# EAGLE design NixieClock (EAGLE 9.6.2)
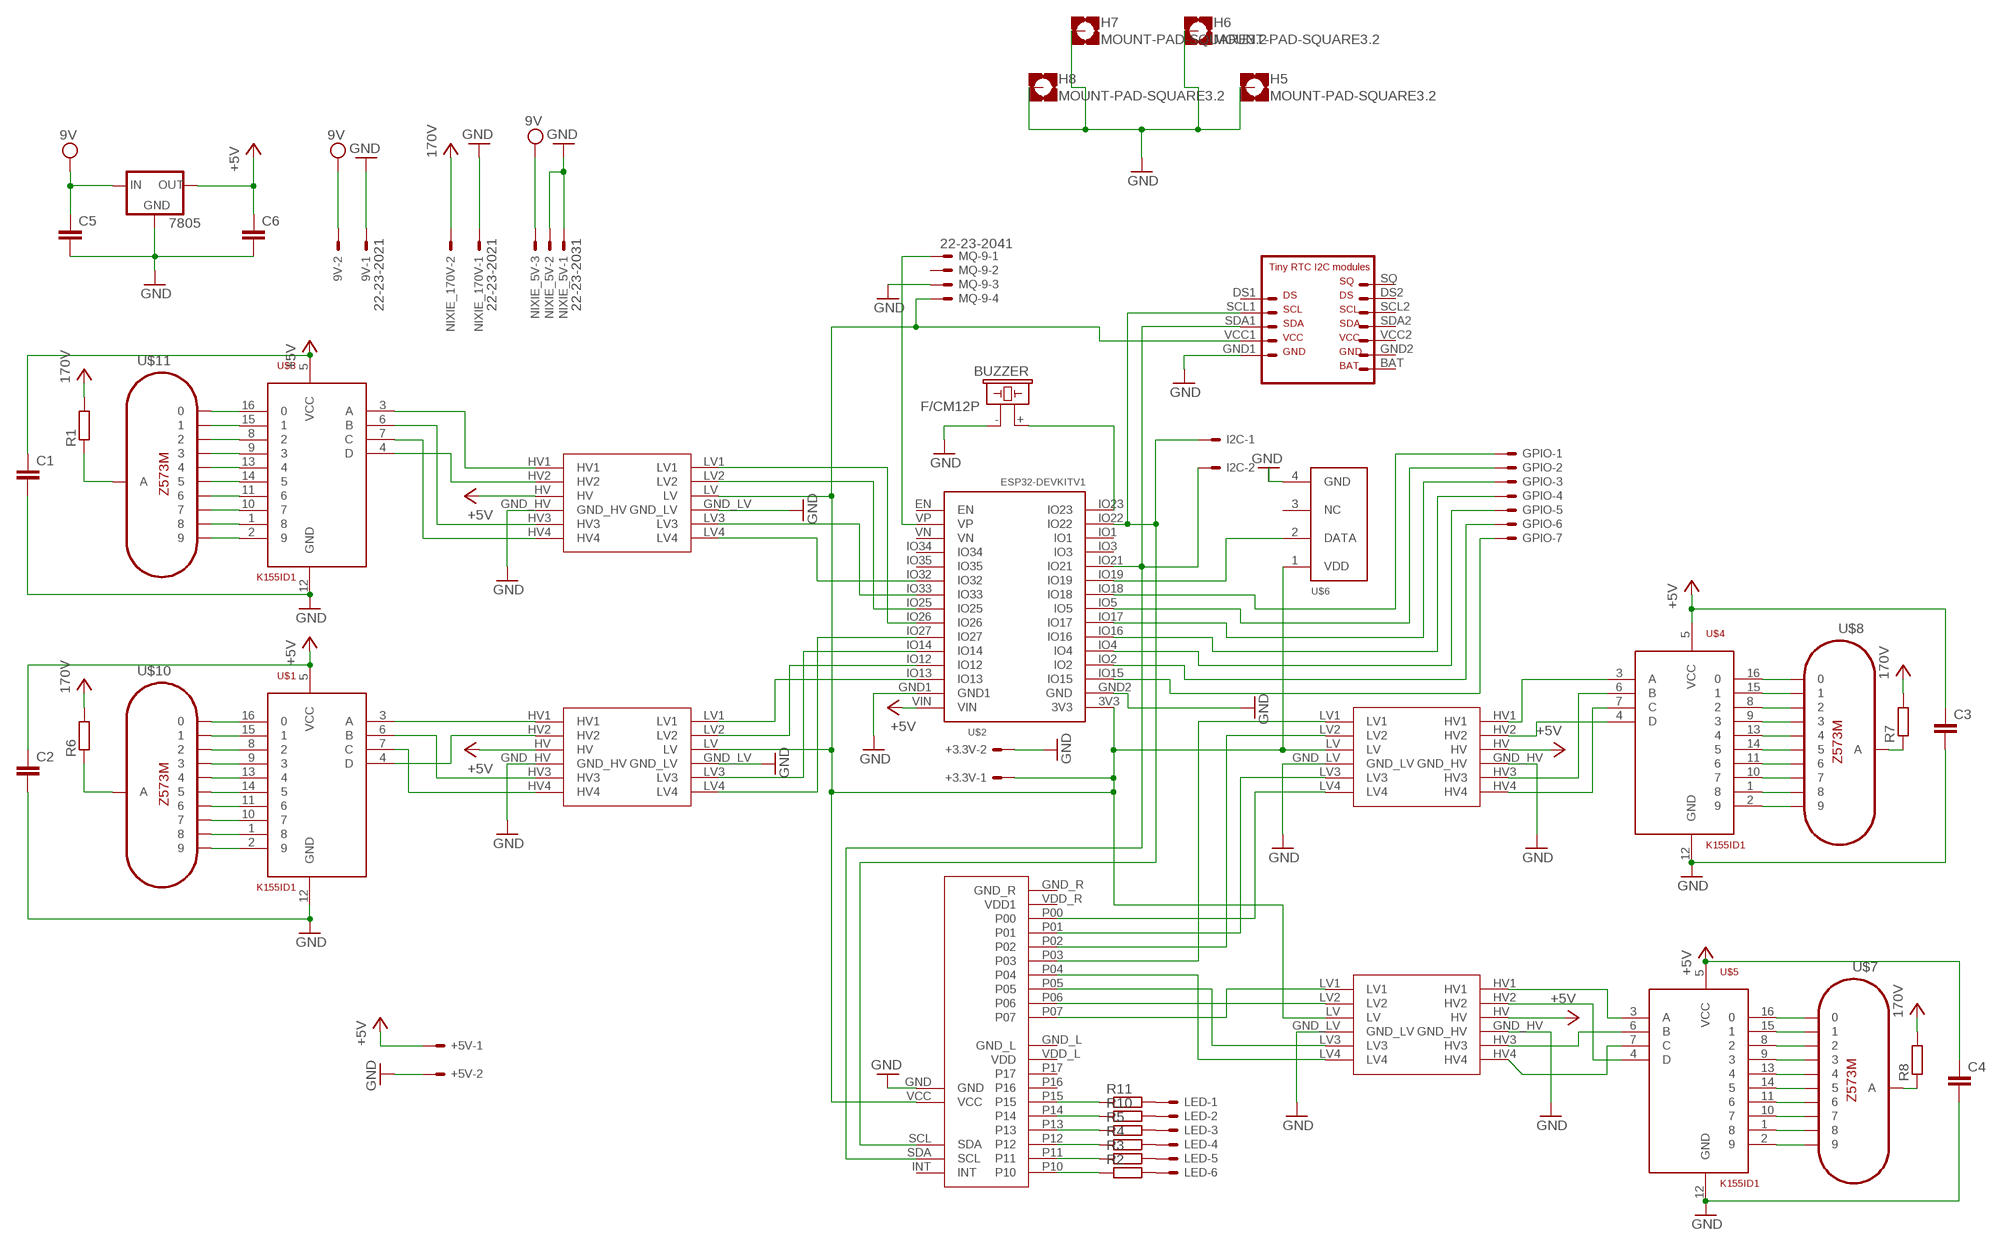
[diagram p0: schematic, sheet 1]

## Parts
9V  22-23-2021  [22-23-2021]
7805  78XXS  [78XXS]
+3.3V  KK-156-2  [KK-156-2]
+5V  KK-156-2  [KK-156-2]
BUZZER  F/CM12P  [F/CM12P]
C1  C2,5-3  [C2.5-3]
C2  C2,5-3  [C2.5-3]
C3  C2,5-3  [C2.5-3]
C4  C2,5-3  [C2.5-3]
C5  C2,5-3  [C2.5-3]
C6  C2,5-3  [C2.5-3]
GPIO  KK-156-7  [KK-156-7]
H5  MOUNT-PAD-SQUARE3.2  [3,2-PAD-SQUARE]
H6  MOUNT-PAD-SQUARE3.2  [3,2-PAD-SQUARE]
H7  MOUNT-PAD-SQUARE3.2  [3,2-PAD-SQUARE]
H8  MOUNT-PAD-SQUARE3.2  [3,2-PAD-SQUARE]
I2C  KK-156-2  [KK-156-2]
LED  KK-156-6  [KK-156-6]
MQ-9  22-23-2041  [22-23-2041]
NIXIE_5V  22-23-2031  [22-23-2031]
NIXIE_170V  22-23-2021  [22-23-2021]
R1  R-EU_0204/7  [0204/7]
R2  R-EU_0204/7  [0204/7]
R3  R-EU_0204/7  [0204/7]
R4  R-EU_0204/7  [0204/7]
R5  R-EU_0204/7  [0204/7]
R6  R-EU_0204/7  [0204/7]
R7  R-EU_0204/7  [0204/7]
R8  R-EU_0204/7  [0204/7]
R10  R-EU_0204/7  [0204/7]
R11  R-EU_0204/7  [0204/7]
STEP_UP_$  LEVEL-CONVERTER  [LEVEL-CONVERTER]
U$1  K155ID1  [DIP16-2.54-19.2X7.62MM]
U$2  ESP32DEVKITV1  [ESP32-DEVKITV1]
U$3  K155ID1  [DIP16-2.54-19.2X7.62MM]
U$4  K155ID1  [DIP16-2.54-19.2X7.62MM]
U$5  K155ID1  [DIP16-2.54-19.2X7.62MM]
U$6  DHT11  [DHT11]
U$7  Z573M  [Z573M]
U$8  Z573M  [Z573M]
U$9  RTC  [RTC]
U$10  Z573M  [Z573M]
U$11  Z573M  [Z573M]
U$12  LEVEL-CONVERTER  [LEVEL-CONVERTER]
U$13  LEVEL-CONVERTER  [LEVEL-CONVERTER]
U$15  LEVEL-CONVERTER  [LEVEL-CONVERTER]
U$16  PCF8575  [PCF8575]

## Nets
3.3V: +3.3V.1 MQ-9.4 STEP_UP_$.LV U$2.3V3 U$6.1(VDD) U$9.VCC1 U$12.LV U$13.LV U$15.LV U$16.VCC
170V: 9V.2 7805.IN C5.1 NIXIE_5V.3 NIXIE_170V.2 R1.2 R6.2 R7.2 R8.2 ; supply symbol labelled 9V
+5V: 7805.OUT +5V.1 C1.1 C2.1 C3.1 C4.1 C6.1 STEP_UP_$.HV U$1.5(VCC) U$2.VIN U$3.5(VCC) U$4.5(VCC) U$5.5(VCC) U$12.HV U$13.HV U$15.HV
GND: 9V.1 7805.GND +3.3V.2 +5V.2 BUZZER.- C1.2 C2.2 C3.2 C4.2 C5.2 C6.2 H5.B3,2(MOUNT) H6.B3,2(MOUNT) H7.B3,2(MOUNT) H8.B3,2(MOUNT) MQ-9.3 NIXIE_5V.1 NIXIE_5V.2 NIXIE_170V.1 STEP_UP_$.GND_HV STEP_UP_$.GND_LV U$1.12(GND) U$2.GND1 U$2.GND2(GND) U$3.12(GND) U$4.12(GND) U$5.12(GND) U$6.4(GND) U$9.GND1 U$12.GND_HV U$12.GND_LV U$13.GND_HV U$13.GND_LV U$15.GND_HV U$15.GND_LV U$16.GND
N$1: STEP_UP_$.HV1 U$5.3(A)
N$2: STEP_UP_$.HV2 U$5.4(D)
N$3: STEP_UP_$.HV3 U$5.6(B)
N$4: STEP_UP_$.HV4 U$5.7(C)
N$5: U$15.LV4 U$16.P00
N$6: U$4.3(A) U$15.HV1
N$7: U$4.4(D) U$15.HV2
N$8: U$4.6(B) U$15.HV3
N$9: U$3.3(A) U$13.HV1
N$10: U$3.4(D) U$13.HV2
N$11: U$3.6(B) U$13.HV3
N$12: U$3.7(C) U$13.HV4
N$13: U$1.3(A) U$12.HV1
N$14: U$1.4(D) U$12.HV2
N$15: U$1.6(B) U$12.HV3
N$16: U$1.7(C) U$12.HV4
N$17: U$3.16 U$11.K0
N$18: U$3.15 U$11.K1
N$19: U$3.8 U$11.K2
N$20: U$3.9 U$11.K3
N$21: U$3.13 U$11.K4
N$22: U$3.14 U$11.K5
N$23: U$3.11 U$11.K6
N$24: U$3.10 U$11.K7
N$25: U$3.1 U$11.K8
N$26: U$3.2 U$11.K9
N$27: U$1.16 U$10.K0
N$28: U$1.15 U$10.K1
N$29: U$1.8 U$10.K2
N$30: U$1.9 U$10.K3
N$31: U$1.13 U$10.K4
N$32: U$1.14 U$10.K5
N$33: U$1.11 U$10.K6
N$34: U$1.10 U$10.K7
N$35: U$1.1 U$10.K8
N$36: U$1.2 U$10.K9
N$37: U$5.16 U$7.K0
N$38: U$5.15 U$7.K1
N$39: U$5.8 U$7.K2
N$40: U$5.9 U$7.K3
N$41: U$5.13 U$7.K4
N$42: U$5.14 U$7.K5
N$43: U$5.11 U$7.K6
N$44: U$5.10 U$7.K7
N$45: U$5.1 U$7.K8
N$46: U$5.2 U$7.K9
N$47: U$4.2 U$8.K9
N$48: U$4.1 U$8.K8
N$49: U$4.10 U$8.K7
N$50: U$4.11 U$8.K6
N$51: U$4.14 U$8.K5
N$52: U$4.13 U$8.K4
N$53: U$4.9 U$8.K3
N$54: U$4.8 U$8.K2
N$55: U$4.15 U$8.K1
N$56: U$4.16 U$8.K0
N$57: U$15.LV3 U$16.P01
N$58: U$2.IO27 U$12.LV4
N$59: I2C.1 U$2.IO22 U$9.SCL1 U$16.SCL(SDA)
N$60: I2C.2 U$2.IO21 U$9.SDA1 U$16.SDA(SCL)
N$61: BUZZER.+ U$2.IO23
N$62: U$15.LV2 U$16.P02
N$63: MQ-9.1 U$2.VP
N$64: U$15.LV1 U$16.P03
N$65: STEP_UP_$.LV4 U$16.P04
N$66: STEP_UP_$.LV3 U$16.P05
N$68: STEP_UP_$.LV2 U$16.P06
N$69: STEP_UP_$.LV1 U$16.P07
N$70: U$2.IO19 U$6.2(DATA)
N$71: GPIO.1 U$2.IO18
N$72: GPIO.2 U$2.IO5
N$73: U$2.IO26 U$13.LV1
N$74: U$2.IO25 U$13.LV2
N$75: U$2.IO33 U$13.LV3
N$76: U$2.IO32 U$13.LV4
N$77: U$2.IO13 U$12.LV1
N$78: U$2.IO12 U$12.LV2
N$79: U$2.IO14 U$12.LV3
N$80: R8.1 U$7.A
N$81: R7.1 U$8.A
N$82: R6.1 U$10.A
N$83: R1.1 U$11.A
N$84: GPIO.3 U$2.IO17
N$85: R2.1 U$16.P10
N$86: R3.1 U$16.P11
N$87: R4.1 U$16.P12
N$88: R5.1 U$16.P13
N$89: R10.1 U$16.P14
N$90: R11.1 U$16.P15
N$91: LED.1 R11.2
N$92: LED.2 R10.2
N$93: LED.3 R5.2
N$94: LED.4 R4.2
N$95: LED.5 R3.2
N$96: LED.6 R2.2
N$97: GPIO.4 U$2.IO16
N$98: GPIO.5 U$2.IO4
N$99: GPIO.6 U$2.IO2
N$100: GPIO.7 U$2.IO15
N$104: U$4.7(C) U$15.HV4
Unconnected: MQ-9.2 U$2.EN U$2.IO1 U$2.IO3 U$2.IO34 U$2.IO35 U$2.VN U$6.3(NC) U$9.BAT U$9.DS1 U$9.DS2 U$9.GND2 U$9.SCL2 U$9.SDA2 U$9.SQ U$9.VCC2 U$16.GND_L U$16.GND_R U$16.INT U$16.P16 U$16.P17 U$16.VDD_L(VDD) U$16.VDD_R(VDD1)

## Library data of the parts
9V NIXIE_170V = con-molex:22-23-2021: .100" (2.54mm) Center Header - 2 Pin; MF: MOLEX; MPN: 22-23-2021; OC_FARNELL: 1462926; OC_NEWARK: 25C3832
7805 = v-reg:78XXS: VOLTAGE REGULATOR
+3.3V +5V I2C = con-molex:KK-156-2: KK 156 HEADER Source: http://www.molex.com/pdm_docs/sd/026604100_sd.pdf; MF: MOLEX; OC_FARNELL: unknown; OC_NEWARK: unknown
BUZZER = buzzer:F/CM12P: BUZZER Source: Buerklin; OC_FARNELL: unknown; OC_NEWARK: unknown
C1-C6 = capacitor-wima:C: CAPACITOR naming: grid - package width
GPIO = con-molex:KK-156-7: KK 156 HEADER Source: http://www.molex.com/pdm_docs/sd/026604100_sd.pdf; MF: MOLEX; OC_FARNELL: unknown; OC_NEWARK: unknown
H5-H8 = holes:MOUNT-PAD-SQUARE: MOUNTING PAD, square
LED = con-molex:KK-156-6: KK 156 HEADER Source: http://www.molex.com/pdm_docs/sd/026604100_sd.pdf; MF: MOLEX; OC_FARNELL: unknown; OC_NEWARK: unknown
MQ-9 = con-molex:22-23-2041: .100" (2.54mm) Center Header - 4 Pin; MF: MOLEX; MPN: wyświetlacz I2C; OC_FARNELL: 1462920; OC_NEWARK: 38C0355
NIXIE_5V = con-molex:22-23-2031: .100" (2.54mm) Center Header - 3 Pin; MF: MOLEX; MPN: 22-23-2031; OC_FARNELL: 1462950; OC_NEWARK: 30C0862
R1-R8 R10 R11 = rcl:R-EU_: RESISTOR, European symbol; SPICEPREFIX: R
STEP_UP_$ U$12 U$13 U$15 = level-converter:LEVEL-CONVERTER
U$1 U$3-U$5 = TimeExpander:K155ID1: Soviet version of SN74141 BCD to Decimal Decoder / Nixie Driver
U$2 = ESP32-DEVKITV1:ESP32DEVKITV1
U$6 = dht:DHT11
U$7 U$8 U$10 U$11 = russian-nixies:Z573M
U$9 = RTC:RTC
U$16 = PCFF8575C:PCF8575

## Board
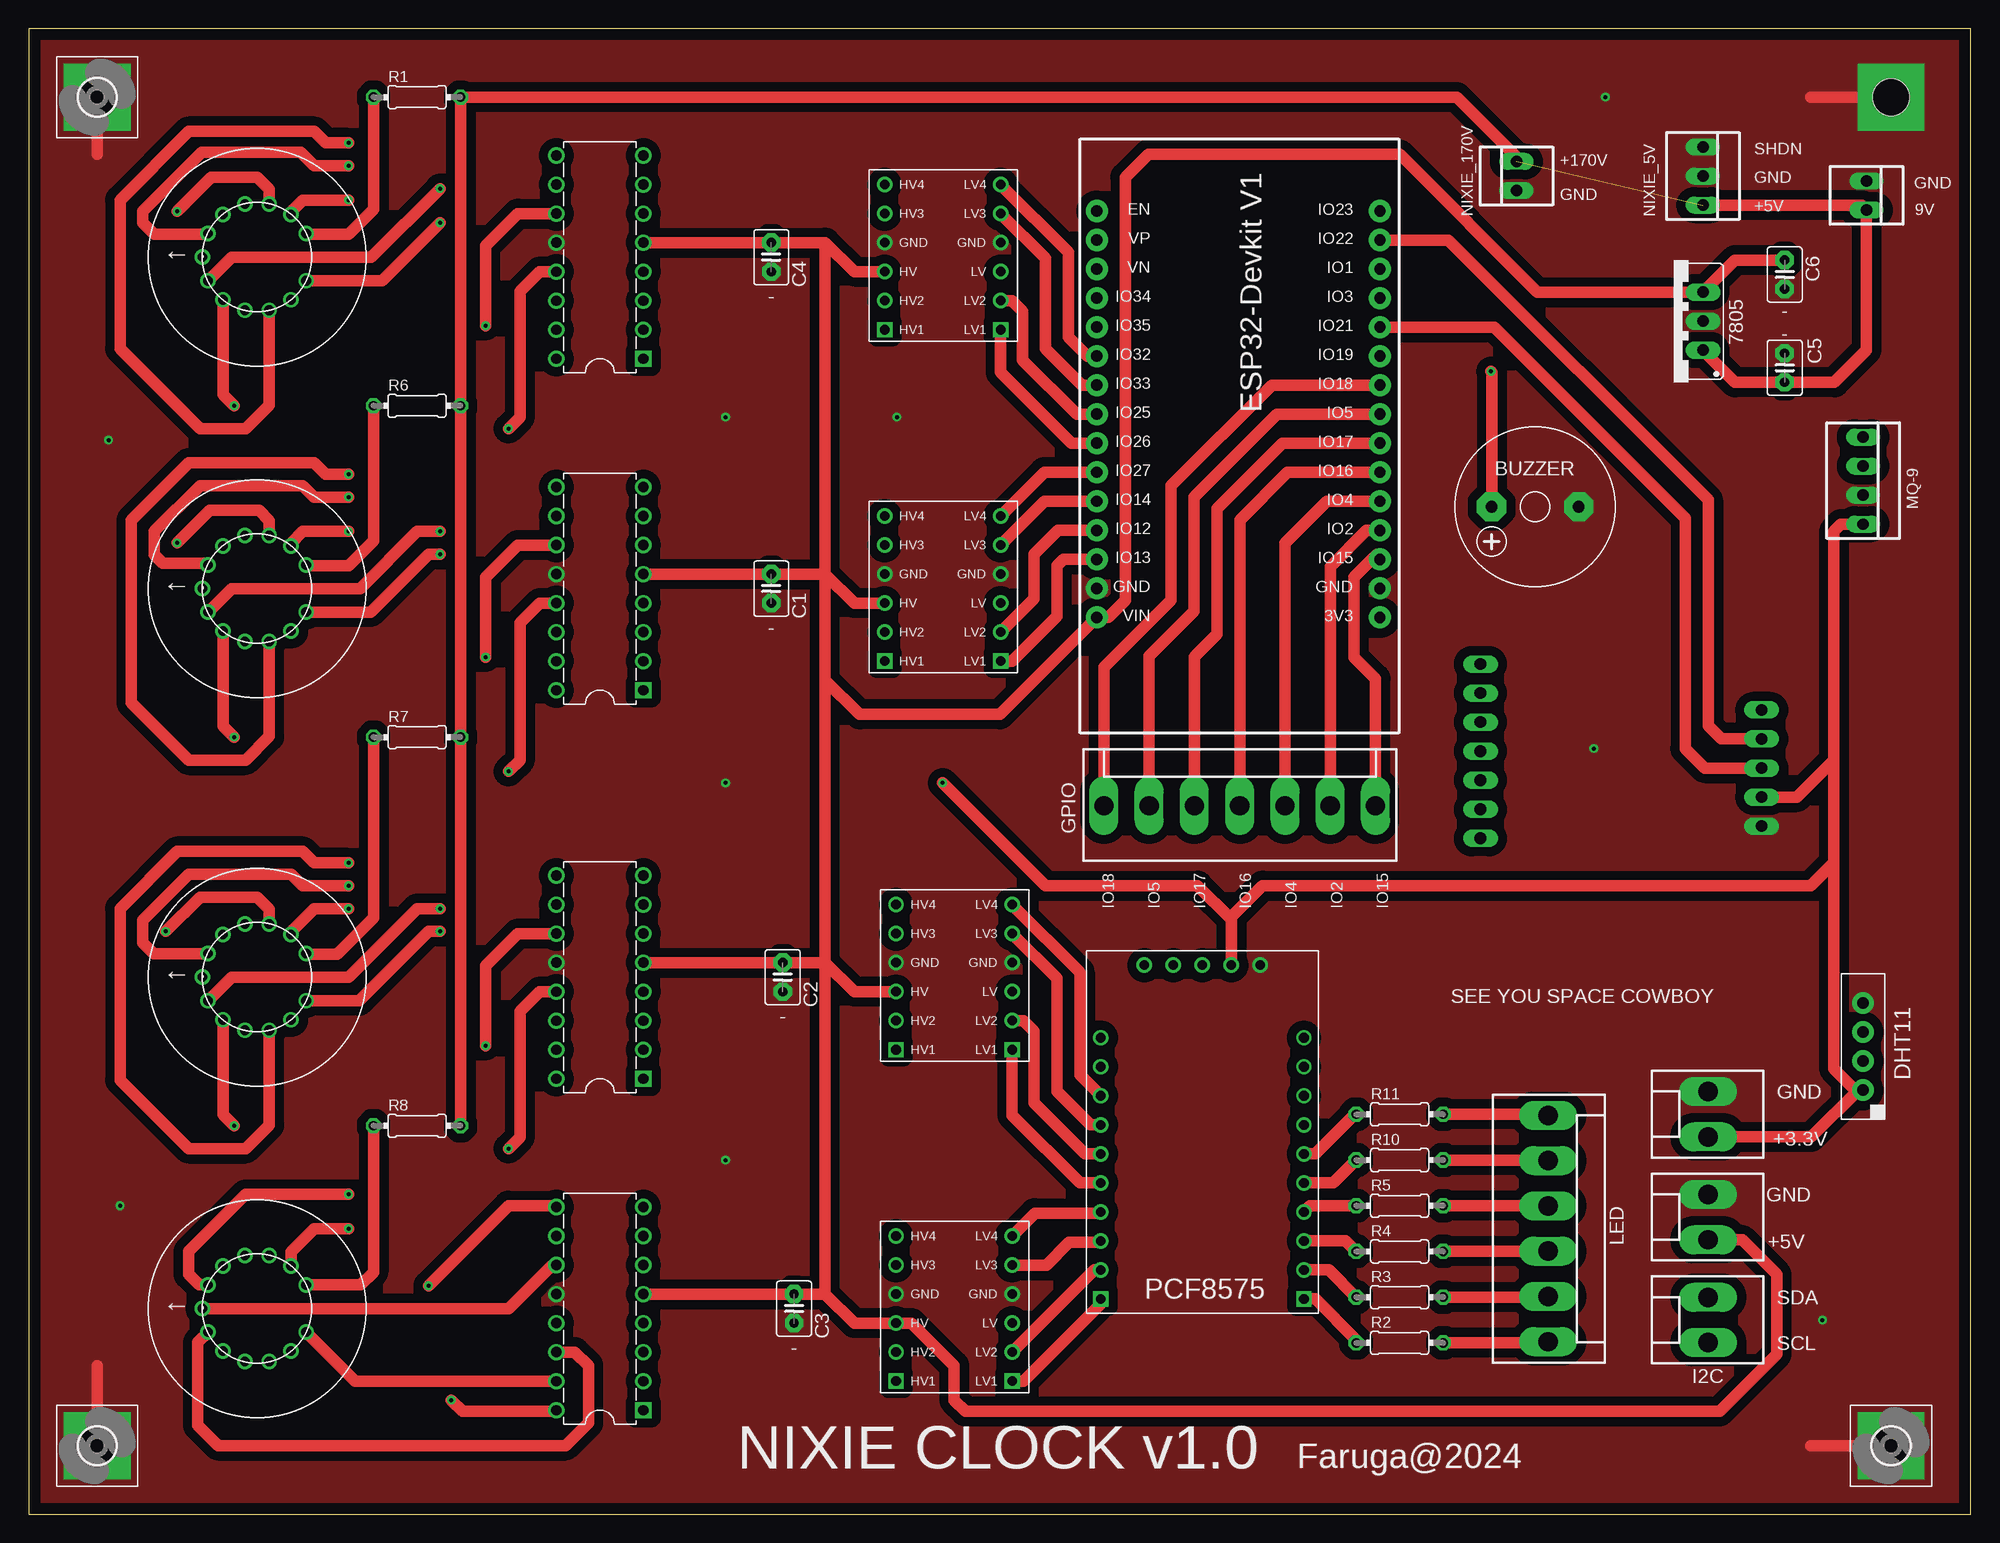
[diagram p1: board, top side]
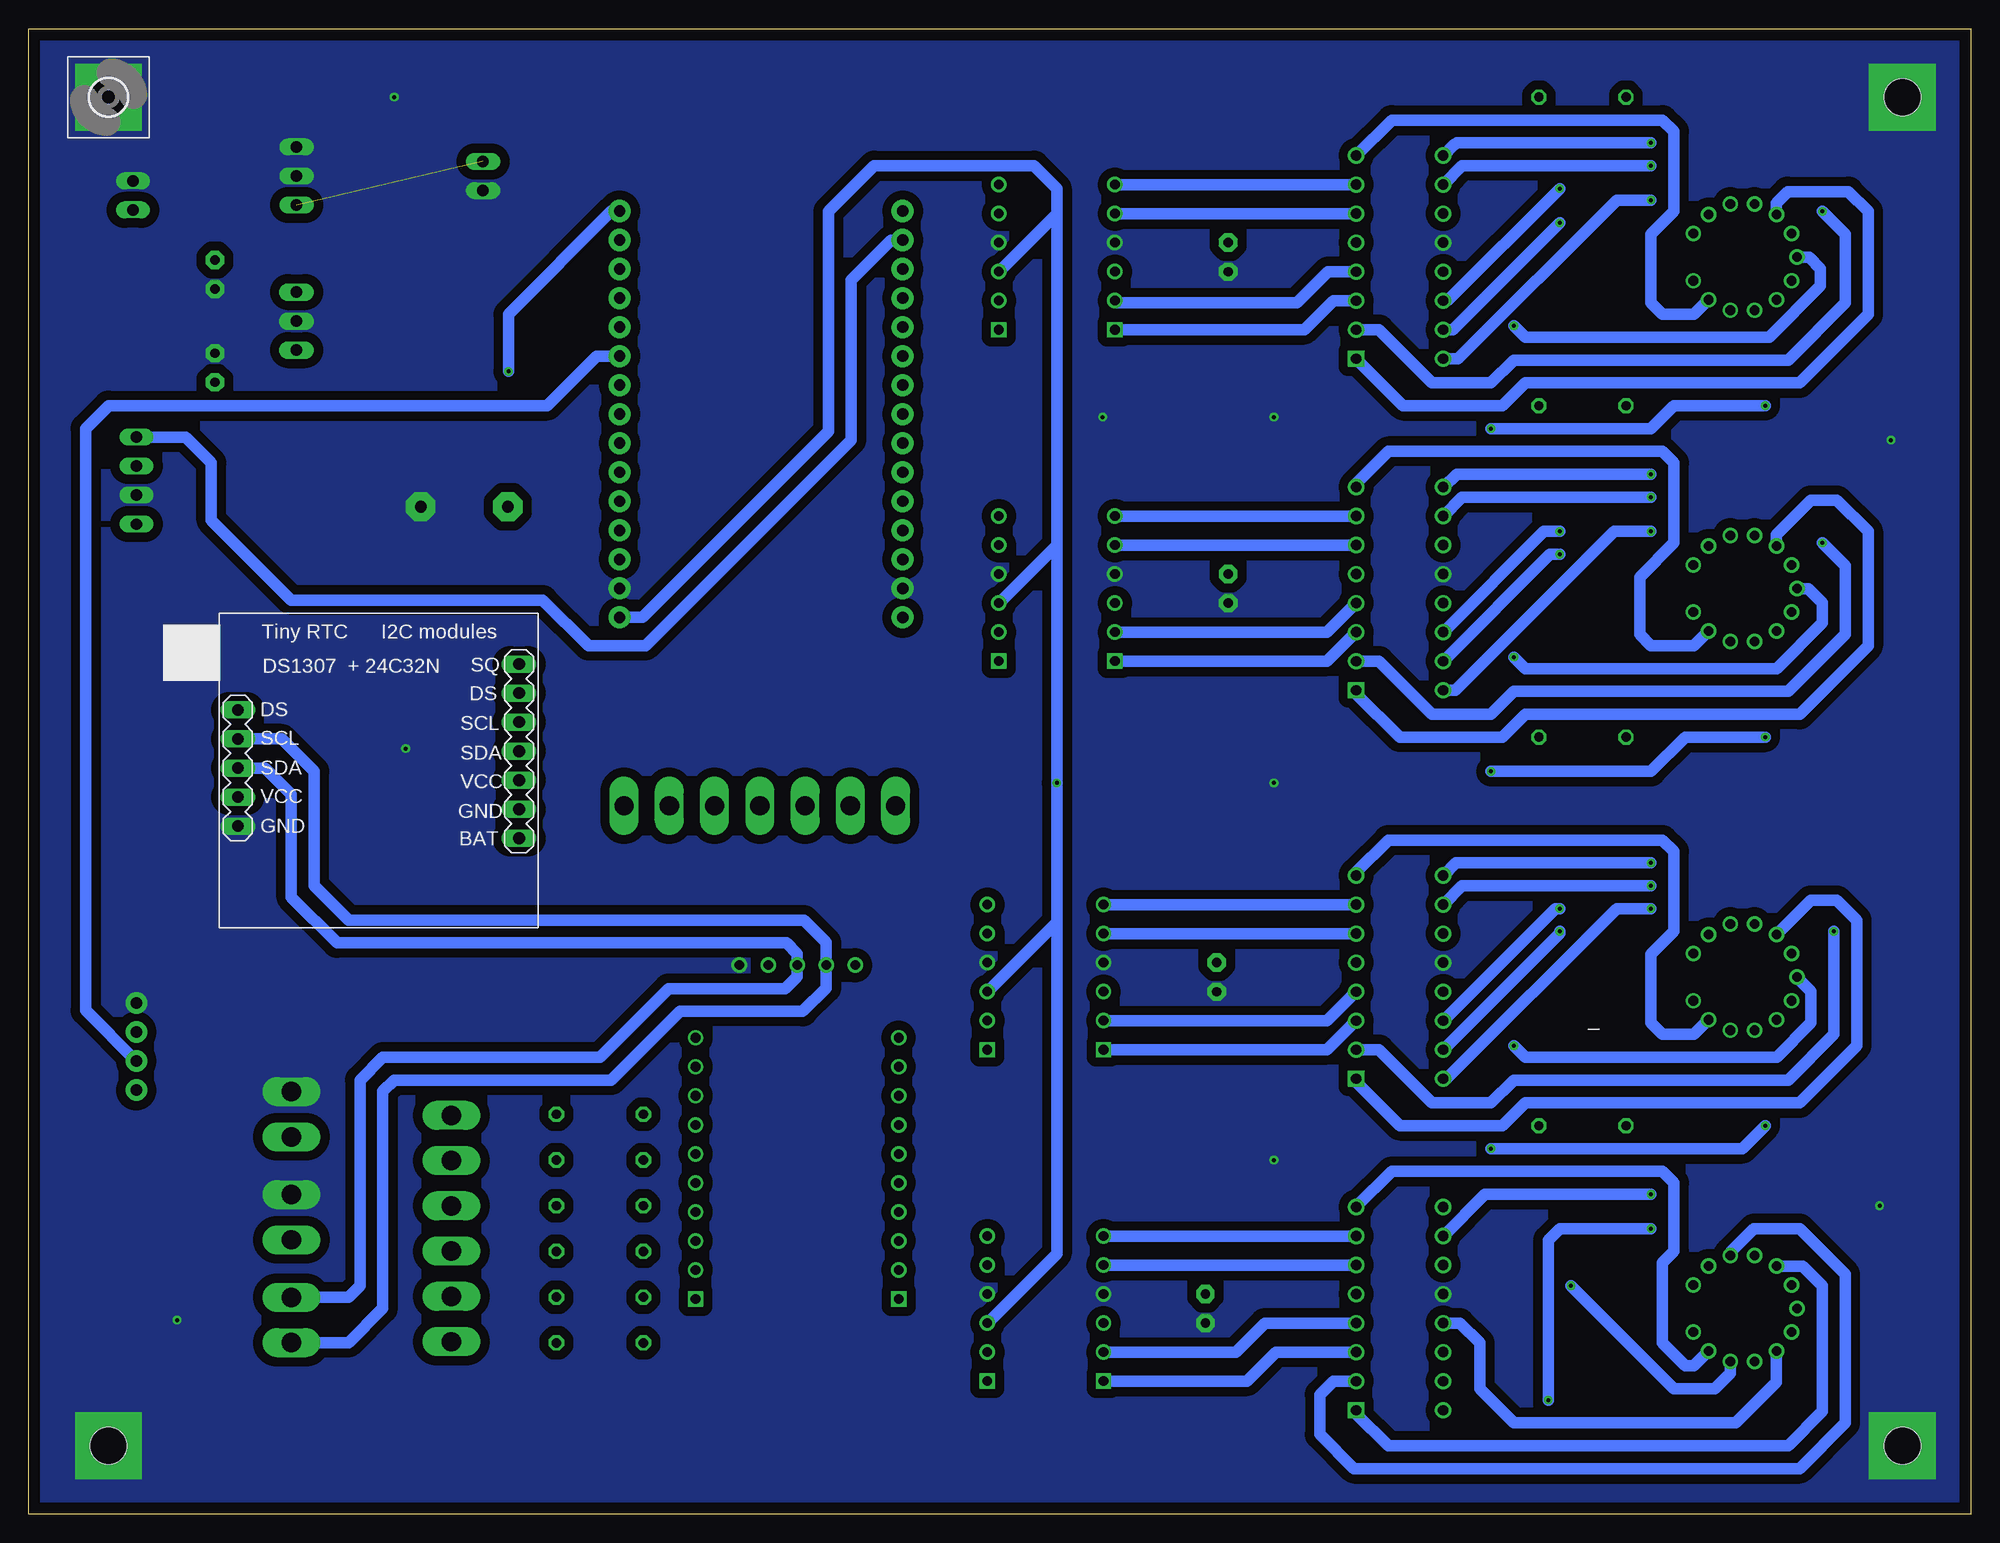
[diagram p2: board, bottom side, seen from below]

Size 170 x 130 mm. Coordinates in mm from the lower left corner, seen from the top.
Outline: 0,0 170,0 170,130 0,130 0,0
Copper layers (1*16): Top 0.035mm / dielectric 1.5mm / Bottom 0.035mm
Design rules "default": minimum track width 6mil, minimum drill 0.35mm, track to track 6mil, track to pad 6mil, pad to pad 6mil, via to via 6mil, smd to smd 6mil, copper to edge 40mil, drill to drill 6mil, minimum pad ring 10mil, minimum via ring 8mil, stop-mask expansion 4mil, vias tented up to drill 0mil, thermal gap 10mil
Holes 3.2 mm at 6,6 6,124 163,124 163,6

### Footprints (pad centres in the part's own frame; a part is rotated, then mirrored left to right if it is on the bottom)
22-23-2021 = drill 1 long: 1 -1.27,0; 2 1.27,0
78XXS = drill 1.016 long: GND 0,-2.54; IN -2.54,-2.54; OUT 2.54,-2.54
KK-156-2 = drill 1.7 pad 2.184 long: 1 -1.98,0; 2 1.98,0
F/CM12P = drill 1.016 pad 2.54 octagon: + 3.81,0; - -3.81,0
C2.5-3 = drill 0.813 pad 1.6 octagon: 1 -1.27,0; 2 1.27,0
KK-156-7 = drill 1.7 pad 2.184 long: 1 -11.88,0; 2 -7.92,0; 3 -3.96,0; 4 0,0; 5 3.96,0; 6 7.92,0; 7 11.88,0
3,2-PAD-SQUARE = drill 3.2 pad 5.842 square: B3,2 0,0
KK-156-6 = drill 1.7 pad 2.184 long: 1 -9.9,0; 2 -5.94,0; 3 -1.98,0; 4 1.98,0; 5 5.94,0; 6 9.9,0
22-23-2041 = drill 1 long: 1 -3.81,0; 2 -1.27,0; 3 1.27,0; 4 3.81,0
22-23-2031 = drill 1 long: 1 -2.54,0; 2 0,0; 3 2.54,0
0204/7 = drill 0.813 octagon: 1 -3.81,0; 2 3.81,0
LEVEL-CONVERTER = drill 0.84: GND_HV 5.08,-1.27; GND_LV -5.08,-1.27; HV 5.08,1.27; HV2 5.08,3.81; HV3 5.08,-3.81; HV4 5.08,-6.35; LV -5.08,1.27; LV2 -5.08,3.81; LV3 -5.08,-3.81; LV4 -5.08,-6.35 | drill 0.84 square: HV1 5.08,6.35; LV1 -5.08,6.35
DIP16-2.54-19.2X7.62MM = drill 0.9 pad 1.4 square: 1 -8.89,-3.81 | drill 0.9 pad 1.4: 2 -6.35,-3.81; 3 -3.81,-3.81; 4 -1.27,-3.81; 5 1.27,-3.81; 6 3.81,-3.81; 7 6.35,-3.81; 8 8.89,-3.81; 9 8.89,3.81; 10 6.35,3.81; 11 3.81,3.81; 12 1.27,3.81; 13 -1.27,3.81; 14 -3.81,3.81; 15 -6.35,3.81; 16 -8.89,3.81
ESP32-DEVKITV1 = drill 1 pad 1.93: 3V3 12.27,-16.52; EN -12.5,19.04; GND1 -12.5,-13.98; GND2 12.27,-13.98; IO1 12.27,13.96; IO2 12.27,-8.9; IO3 12.27,11.42; IO4 12.27,-6.36; IO5 12.27,1.26; IO12 -12.5,-8.9; IO13 -12.5,-11.44; IO14 -12.5,-6.36; IO15 12.27,-11.44; IO16 12.27,-3.82; IO17 12.27,-1.28; IO18 12.27,3.8; IO19 12.27,6.34; IO21 12.27,8.88; IO22 12.27,16.5; IO23 12.27,19.04; IO25 -12.5,1.26; IO26 -12.5,-1.28; IO27 -12.5,-3.82; IO32 -12.5,6.34; IO33 -12.5,3.8; IO34 -12.5,11.42; IO35 -12.5,8.88; VIN -12.5,-16.52; VN -12.5,13.96; VP -12.5,16.5
DHT11 = drill 1.016 pad 1.88: 1 -3.81,0; 2 -1.27,0; 3 1.27,0; 4 3.81,0
Z573M = drill 0.84: A 2.067,-4.293; DP 4.646,1.06; IC -4.646,1.06; K0 3.725,-2.971; K1 -2.067,-4.293; K2 -3.725,-2.971; K3 -4.646,-1.06; K4 -3.725,2.971; K5 -2.067,4.293; K6 0,4.765; K7 2.067,4.293; K8 3.725,2.971; K9 4.646,-1.06
RTC = drill 1.016 long: BAT 25.75,7.82; DS1 1.13,19.05; DS2 25.75,20.52; GND1 1.13,8.89; GND2 25.75,10.36; SCL1 1.13,16.51; SCL2 25.75,17.98; SDA1 1.13,13.97; SDA2 25.75,15.44; SQ 25.75,23.06; VCC1 1.13,11.43; VCC2 25.75,12.9
PCF8575 = drill 0.84: GND -3.81,-19.05; GND_L -7.62,-12.7; GND_R 10.16,-12.7; INT 6.35,-19.05; P00 10.16,-7.62; P01 10.16,-5.08; P02 10.16,-2.54; P03 10.16,0; P04 10.16,2.54; P05 10.16,5.08; P06 10.16,7.62; P11 -7.62,7.62; P12 -7.62,5.08; P13 -7.62,2.54; P14 -7.62,0; P15 -7.62,-2.54; P16 -7.62,-5.08; P17 -7.62,-7.62; SCL 3.81,-19.05; SDA 1.27,-19.05; VCC -1.27,-19.05; VDD_L -7.62,-10.16; VDD_R 10.16,-10.16 | drill 0.84 square: P07 10.16,10.16; P10 -7.62,10.16

### Placement (x,y rotation side)
9V  160.86,115.4 270 top
7805  144,104.4 90 top
+3.3V  147,35 90 top
+5V  147,26 90 top
BUZZER  131.86,88.16 180 top
C1  65,81 270 top
C2  66,47 270 top
C3  67,18 270 top
C4  65,110 270 top
C5  153.7,100.32 90 top
C6  153.7,108.48 270 top
GPIO  106,62 0 top
H5  6,6 0 top
H6  6,124 0 top
H7  163,6 0 top
H8  163,124 0 bottom
I2C  147,17 90 top
LED  133,25 270 top
MQ-9  160.56,90.44 270 top
NIXIE_5V  146.54,117.1 270 top
NIXIE_170V  130.22,117.1 90 top
R1  34,124 0 top
R2  120,15 0 top
R3  120,19 0 top
R4  120,23 0 top
R5  120,27 0 top
R6  34,97 0 top
R7  34,68 0 top
R8  34,34 0 top
R10  120,31 0 top
R11  120,35 0 top
STEP_UP_$  81,18 180 top
U$1  50,81 90 top
U$2  106,95 0 top
U$3  50,110 90 top
U$4  50,47 90 top
U$5  50,18 90 top
U$6  160.56,40.93 90 top
U$7  20,18 90 top
U$8  20,47 90 top
U$9  152.82,51.33 0 bottom
U$10  20,81 90 top
U$11  20,110 90 top
U$12  80,81 180 top
U$13  80,110 180 top
U$15  81,47 180 top
U$16  104,29 180 top

### Tracks (layer width: path | path; a pad name or v marks a point on that pad's centre or on a via)
3.3V  (via drill 0.35)
  Top 1.016: v80,64 89,55 102.32,55 105.27,52.05 U$16.VCC 105.27,52.27 108,55 156,55 158,57 | MQ-9.4 158.63,86.63 158,86 158,66 | U$9.VCC1 154.76,62.76 158,66 | 158,66 158,57 | 158,57 158,39 159.88,37.12 U$6.1 160.12,37.12 156.02,33.02 +3.3V.1
  Bottom 1.016: 80,113.81 80,116 82,118 96,118 100,114 100,94.75 116.27,78.48 U$2.3V3 | 80,113.81 80,84.81 | 80,84.81 v80,64 80,51.81 | U$12.LV 80,84.81 | U$15.LV 80,51.81 | U$13.LV 80,113.81 | STEP_UP_$.LV 80,22.81 80,51.81
170V  (1 unrouted)
  Top 1.016: NIXIE_170V.2 130.22,118.78 125,124 R1.2 R6.2 R7.2 R8.2 | 7805.IN 149.35,99.05 C5.1 158.05,99.05 160.86,101.86 9V.2 160.43,114.56 NIXIE_5V.3
+5V
  Top 1.016: U$1.5 C1.1 69.73,82.27 | U$3.5 C4.1 69.73,111.27 | U$13.HV 72.27,108.73 69.73,111.27 | 69.73,48.27 C2.1 U$4.5 | 69.73,19.27 C3.1 U$5.5 | 69.73,19.27 69.73,48.27 | 69.73,48.27 69.73,73 | 69.73,73 69.73,82.27 | 69.73,82.27 69.73,111.27 | 69.73,19.27 72.27,16.73 STEP_UP_$.HV 77.27,16.73 81,13 81,10 82,9 148,9 153,14 153,21 149.98,24.02 +5V.1 | U$15.HV 72.27,45.73 69.73,48.27 | C6.1 149.35,109.75 7805.OUT 132.06,106.94 120,119 98,119 96,117 96,79.98 94.5,78.48 U$2.VIN 85.02,70 72.73,70 69.73,73 | U$12.HV 72.27,79.73 69.73,82.27
GND  (via drill 0.35)
  Top 1.016: 6,121 H6.B3,2 6,119 | H5.B3,2 6,13 | H7.B3,2 156,6 | H8.B3,2 156,124
  Bottom 1.016: 93.48,81 U$2.GND1
  other vias: 137,67 61,96 76,96 138,124 157,17 61,31 61,64 7,94 8,27
  pour Bottom (isolate 0.813, no thermals): 0,130 0,0 170,0 170,130
  pour Top (isolate 0.813, no thermals): 0,130 0,0 170,0 170,130
N$1
  Bottom 1.016: STEP_UP_$.HV1 63.35,11.65 60.81,14.19 U$5.3
N$2
  Bottom 1.016: STEP_UP_$.HV2 64.35,14.19 61.81,16.73 U$5.4
N$3
  Bottom 1.016: STEP_UP_$.HV3 U$5.6
N$4
  Bottom 1.016: STEP_UP_$.HV4 U$5.7
N$5
  Top 1.016: U$15.LV4 92,47.43 92,38.46 U$16.P00
N$6
  Bottom 1.016: U$15.HV1 56.35,40.65 U$4.3
N$7
  Bottom 1.016: U$15.HV2 56.35,43.19 U$4.4
N$8
  Bottom 1.016: U$15.HV3 U$4.6
N$9
  Bottom 1.016: U$13.HV1 58.35,103.65 55.81,106.19 U$3.3
N$10
  Bottom 1.016: U$13.HV2 74.73,106 59,106 56.27,108.73 U$3.4
N$11
  Bottom 1.016: U$13.HV3 U$3.6
N$12
  Bottom 1.016: U$13.HV4 U$3.7
N$13
  Bottom 1.016: U$12.HV1 56.35,74.65 U$1.3
N$14
  Bottom 1.016: U$12.HV2 56.35,77.19 U$1.4
N$15
  Bottom 1.016: U$12.HV3 U$1.6
N$16
  Bottom 1.016: U$12.HV4 U$1.7
N$17  (via drill 0.35)
  Top 1.016: v28,115 24,115 22.97,113.97 U$11.K0
  Bottom 1.016: U$3.16 44.89,101.11 31,115 v28,115
N$18  (via drill 0.35)
  Top 1.016: v36,113 30.93,107.93 U$11.K1
  Bottom 1.016: U$3.15 45.35,103.65 v36,113
N$19
  Bottom 1.016: U$3.8 50.7,122 27,122 26,121 26,114 28,112 28,106 27,105 24.25,105 U$11.K2
N$20  (via drill 0.35)
  Top 1.016: v28,120 26,120 25,121 14,121 8,115 8,102 15,95 19,95 21.06,97.06 U$11.K3
  Bottom 1.016: U$3.9 45.19,119.89 45.11,119.89 45,120 v28,120
N$21  (via drill 0.35)
  Top 1.016: U$11.K4 17.03,97.97 v18,97 | v42,95 43,96 43,107 44.73,108.73 U$3.13
  Bottom 1.016: v18,97 26,97 28,95 v42,95
N$22  (via drill 0.35)
  Top 1.016: v36,116 30,110 17.77,110 U$11.K5
  Bottom 1.016: U$3.14 45.81,106.19 v36,116
N$23  (via drill 0.35)
  Top 1.016: v40,104 40,111 42.81,113.81 U$3.11
  Bottom 1.016: U$11.K6 14.17,110 13.17,109 13.17,107.48 17.65,103 39,103 v40,104
N$24  (via drill 0.35)
  Top 1.016: v28,118 25,118 23.83,119.17 15.17,119.17 10,114 10,113 11,112 15.64,112 U$11.K7
  Bottom 1.016: v28,118 44.54,118 U$3.10
N$25
  Bottom 1.016: U$3.1 49.7,97 41,97 39,99 15,99 9,105 9,114 10.72,115.72 16.03,115.72 17.03,114.72 U$11.K8
N$26  (via drill 0.35)
  Top 1.016: v13,114 16,117 20,117 21.06,115.94 U$11.K9
  Bottom 1.016: v13,114 11,112 11,106 16,101 40,101 42,99 47.16,99 51.81,103.65 U$3.2
N$27  (via drill 0.35)
  Top 1.016: v28,86 24,86 22.97,84.97 U$10.K0
  Bottom 1.016: U$1.16 45.11,72.11 31.22,86 v28,86
N$28  (via drill 0.35)
  Top 1.016: U$10.K1 29.93,78.93 35,84 v36,84
  Bottom 1.016: U$1.15 36.84,84 v36,84
N$29
  Bottom 1.016: U$1.8 53.81,90.19 51,93 27,93 26,92 26,85 29,82 29,77 28,76 24.25,76 U$10.K2
N$30  (via drill 0.35)
  Top 1.016: U$10.K3 21.06,68.06 19,66 14,66 9,71 9,87 14,92 25,92 26,91 v28,91
  Bottom 1.016: U$1.9 46.11,89.89 45,91 v28,91
N$31  (via drill 0.35)
  Top 1.016: U$1.13 44.73,79.73 43,78 43,66 v42,65 | U$10.K4 17.03,68.97 v18,68
  Bottom 1.016: v42,65 28,65 25,68 v18,68
N$32  (via drill 0.35)
  Top 1.016: v36,86 34,86 29,81 17.77,81 U$10.K5
  Bottom 1.016: U$1.14 37.38,86 v36,86
N$33  (via drill 0.35)
  Top 1.016: U$1.11 42.81,84.81 40,82 v40,75
  Bottom 1.016: U$10.K6 14.23,81 13,79.77 13,78 17,74 39,74 v40,75
N$34  (via drill 0.35)
  Top 1.016: U$10.K7 15.56,83.21 11.73,83.21 11,83.95 11,86 15,90 24,90 25,89 v28,89
  Bottom 1.016: U$1.10 44.54,89 v28,89
N$35
  Bottom 1.016: U$10.K8 17.03,85.72 14.03,88.72 11.72,88.72 9,86 9,76 15,70 39,70 41,68 50,68 53.81,71.81 U$1.1
N$36  (via drill 0.35)
  Top 1.016: v13,85 15.83,87.83 20.17,87.83 21.06,86.94 U$10.K9
  Bottom 1.016: v13,85 11,83 11,77 16,72 40,72 42,70 47.16,70 51.81,74.65 U$1.2
N$37  (via drill 0.35)
  Top 1.016: U$5.16 46.08,9 38,9 v37,10 | v28,25 25,25 22.97,22.97 U$7.K0
  Bottom 1.016: v37,10 37,24 36,25 v28,25
N$38
  Top 1.016: U$7.K1 28.58,11.65 U$5.15
N$39
  Bottom 1.016: U$5.8 50.7,30 27,30 26,29 26,23 27,22 27,15 25,13 24.25,13 U$7.K2
N$40  (via drill 0.35)
  Top 1.016: v35,20 42,27 46.08,27 U$5.9
  Bottom 1.016: U$7.K3 21.06,12.35 22.41,11 26,11 v35,20
N$41
  Bottom 1.016: U$5.13 44.73,16.73 43,15 43,11 40,8 20.58,8 17.03,11.55 U$7.K4
N$42
  Top 1.016: U$7.K5 14.81,15.04 14.81,7.77 16.59,6 47,6 49,8 49,13 47.81,14.19 U$5.14
N$43
  Top 1.016: U$5.11 45.81,21.81 42,18 U$7.K6
N$44  (via drill 0.35)
  Top 1.016: U$7.K7 14.93,20.07 14,21 14,23 19,28 v28,28
  Bottom 1.016: U$5.10 42.54,28 v28,28
N$45
  Bottom 1.016: U$5.1 53.81,8.81 51,6 16,6 13,9 13,20 14.72,21.73 U$7.K8
N$46
  Bottom 1.016: U$5.2 55.81,11.65 57,10.46 57,7 54,4 15,4 11,8 11,21 15,25 19,25 21.06,22.94 U$7.K9
N$47  (via drill 0.35)
  Top 1.016: v12,51 15,54 20,54 21.06,52.94 U$8.K9
  Bottom 1.016: v12,51 12,42 16,38 40,38 42,36 47.16,36 51.81,40.65 U$4.2
N$48
  Bottom 1.016: U$4.1 53.96,37.96 50,34 41,34 39,36 15,36 10,41 10,52 11.72,53.73 14.03,53.73 U$8.K8
N$49  (via drill 0.35)
  Top 1.016: v28,55 24,55 23,56 14,56 10,52 10,50 10.93,49.07 U$8.K7
  Bottom 1.016: U$4.10 44.54,55 v28,55
N$50  (via drill 0.35)
  Top 1.016: U$4.11 42.81,50.81 40,48 v40,41
  Bottom 1.016: U$8.K6 14,45.77 14,43 17,40 39,40 v40,41
N$51  (via drill 0.35)
  Top 1.016: v36,53 34,53 28,47 17.77,47 U$8.K5
  Bottom 1.016: U$4.14 36.38,53 v36,53
N$52  (via drill 0.35)
  Top 1.016: U$8.K4 17.03,34.97 v18,34 | U$4.13 44.73,45.73 43,44 43,33 v42,32
  Bottom 1.016: v18,34 20,32 v42,32
N$53  (via drill 0.35)
  Top 1.016: U$8.K3 21.06,34.06 19,32 14,32 8,38 8,53 13,58 24,58 25,57 v28,57
  Bottom 1.016: U$4.9 45.08,57 v28,57
N$54
  Bottom 1.016: U$4.8 53.81,56.19 51,59 27,59 26,58 26,51 28,49 28,43 27,42 24.25,42 U$8.K2
N$55  (via drill 0.35)
  Top 1.016: v36,51 35,51 28.93,44.93 U$8.K1
  Bottom 1.016: U$4.15 36,50.84 v36,51
N$56  (via drill 0.35)
  Top 1.016: v28,53 25,53 22.97,50.97 U$8.K0
  Bottom 1.016: U$4.16 45.89,38.11 31,53 v28,53
N$57
  Top 1.016: U$15.LV3 90,46.89 90,37 92.92,34.08 U$16.P01
N$58
  Top 1.016: U$12.LV4 88.91,91.18 U$2.IO27
N$59
  Top 1.016: U$2.IO22 124.27,111.5 147,88.77 147,69 148.16,67.84 U$9.SCL1
  Bottom 1.016: U$9.SCL1 147.84,67.84 145,65 145,55 142,52 102.14,52 100.19,50.05 U$16.SCL 100.19,46.05 102.24,44 113,44 119,38 138,38 139,37 139,18.02 142,15.02 I2C.1
N$60
  Top 1.016: U$2.IO21 128.27,103.88 145,87.15 145,67 146.7,65.3 U$9.SDA1
  Bottom 1.016: U$9.SDA1 149.3,65.3 147,63 147,54 143,50 103.68,50 102.73,49.05 U$16.SDA 102.73,47.05 103.78,46 114,46 120,40 139,40 141,38 141,19.98 142,18.98 I2C.2
N$61  (via drill 0.35)
  Top 1.016: v128,100 128.05,99.95 BUZZER.+
  Bottom 1.016: U$2.IO23 118.96,114.04 128,105 v128,100
N$62
  Top 1.016: U$15.LV2 87.08,43.19 88,42.27 88,36 92.46,31.54 U$16.P02
N$63
  Bottom 1.016: U$2.VP 94.5,111.5 98,108 98,94 116,76 121,76 125,80 147,80 154,87 154,92 156.25,94.25 MQ-9.1
N$64
  Top 1.016: U$15.LV1 86.08,34.92 92,29 U$16.P03
N$65
  Top 1.016: U$16.P04 93.73,26.35 88.08,26.35 STEP_UP_$.LV4
N$66
  Top 1.016: U$16.P05 93.73,23.81 91.08,23.81 89.08,21.81 STEP_UP_$.LV3
N$68
  Top 1.016: STEP_UP_$.LV2 93.27,21.38 U$16.P06
N$69
  Top 1.016: STEP_UP_$.LV1 87.08,11.65 93.84,18.41 U$16.P07
N$70
  Bottom 1.016: U$2.IO19 120.27,101.34 124.61,97 163,97 165,95 165,44.1 U$6.2
N$71
  Top 1.016: GPIO.1 94.12,74.12 100,80 100,90 108.8,98.8 U$2.IO18
N$72
  Top 1.016: GPIO.2 98.08,75.08 102,79 102,89 109.26,96.26 U$2.IO5
N$73
  Top 1.016: U$13.LV1 85.08,99.92 91.28,93.72 U$2.IO26
N$74
  Top 1.016: U$13.LV2 86.08,106.19 87,105.27 87,101 91.74,96.26 U$2.IO25
N$75
  Top 1.016: U$13.LV3 89,109.89 89,102 92.2,98.8 U$2.IO33
N$76
  Top 1.016: U$13.LV4 91,110.43 91,103 92.66,101.34 U$2.IO32
N$77
  Top 1.016: U$12.LV1 86.08,74.65 90,78.57 90,83 90.56,83.56 U$2.IO13
N$78
  Top 1.016: U$12.LV2 88,80.11 88,84 90.1,86.1 U$2.IO12
N$79
  Top 1.016: U$12.LV3 88.91,88.64 U$2.IO14
N$80
  Top 1.016: R8.1 30.19,21.19 29.07,20.07 U$7.A
N$81
  Top 1.016: R7.1 30.19,52.19 27,49 24.36,49 U$8.A
N$82
  Top 1.016: R6.1 30.19,85.19 28,83 24.36,83 U$10.A
N$83
  Top 1.016: R1.1 30.19,114.19 28,112 24.36,112 U$11.A
N$84
  Top 1.016: GPIO.3 102.04,75.04 104,77 104,88 109.72,93.72 U$2.IO17
N$85
  Top 1.016: U$16.P10 112.62,18.84 116.19,15.27 R2.1
N$86
  Top 1.016: U$16.P11 113.81,21.38 R3.1
N$87
  Top 1.016: U$16.P12 115.27,23.92 R4.1
N$88
  Top 1.016: U$16.P13 112.16,27 R5.1
N$89
  Top 1.016: R10.1 114.19,29 U$16.P14
N$90
  Top 1.016: U$16.P15 112.62,31.54 116.08,35 R11.1
N$91
  Top 1.016: LED.1 132.9,35 R11.2
N$92
  Top 1.016: LED.2 132.94,31 R10.2
N$93
  Top 1.016: LED.3 132.98,27 R5.2
N$94
  Top 1.016: LED.4 132.98,23 R4.2
N$95
  Top 1.016: LED.5 132.94,19 R3.2
N$96
  Top 1.016: LED.6 132.9,15 R2.2
N$97
  Top 1.016: GPIO.4 106,87 110.18,91.18 U$2.IO16
N$98
  Top 1.016: GPIO.5 109.96,84.96 113.64,88.64 U$2.IO4
N$99
  Top 1.016: GPIO.6 113.92,82.92 117.1,86.1 U$2.IO2
N$100
  Top 1.016: GPIO.7 117.88,73.12 116,75 116,82 118,84 118.27,83.73 U$2.IO15
N$104
  Bottom 1.016: U$15.HV4 U$4.7

### Text on the board
tNames: SHDN | +170V | GND | GND | GND | +5V | - | - | - | - | IO18 | IO5 | IO17 | IO16 | IO4 | IO2 | IO15 | SEE YOU SPACE COWBOY | - | DHT11 | GND | GND | SDA | SCL | - | NIXIE CLOCK v1.0 | Faruga@2024
bNames: ಠ_ಠ